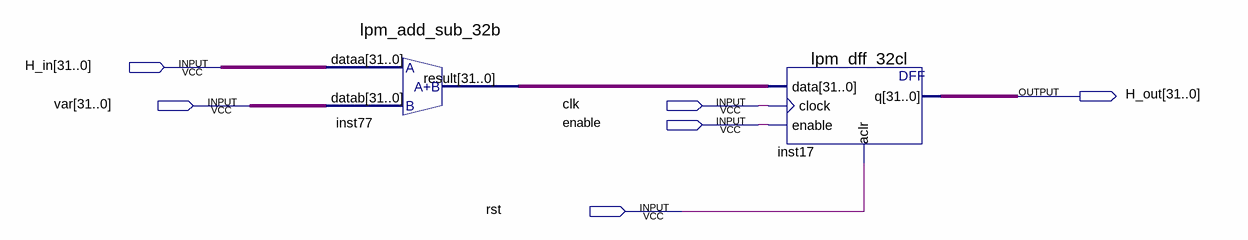
[diagram p0: schematic sheet]
// Quartus schematic final_H.bdf as structural Verilog: 2 symbols, 6 pins
module final_H (
  input  [31:0] H_in,
  input  [31:0] \var ,
  input  clk,
  input  enable,
  input  rst,
  output [31:0] H_out
);

  wire [31:0] inst77_result;

  lpm_add_sub_32b inst77 (.dataa(H_in), .datab(\var ), .result(inst77_result));
  lpm_dff_32cl inst17 (.data(inst77_result), .clock(clk), .enable(enable), .aclr(rst), .q(H_out));
endmodule
